# Altium schematic sheet AD7606.SchDoc
size A4
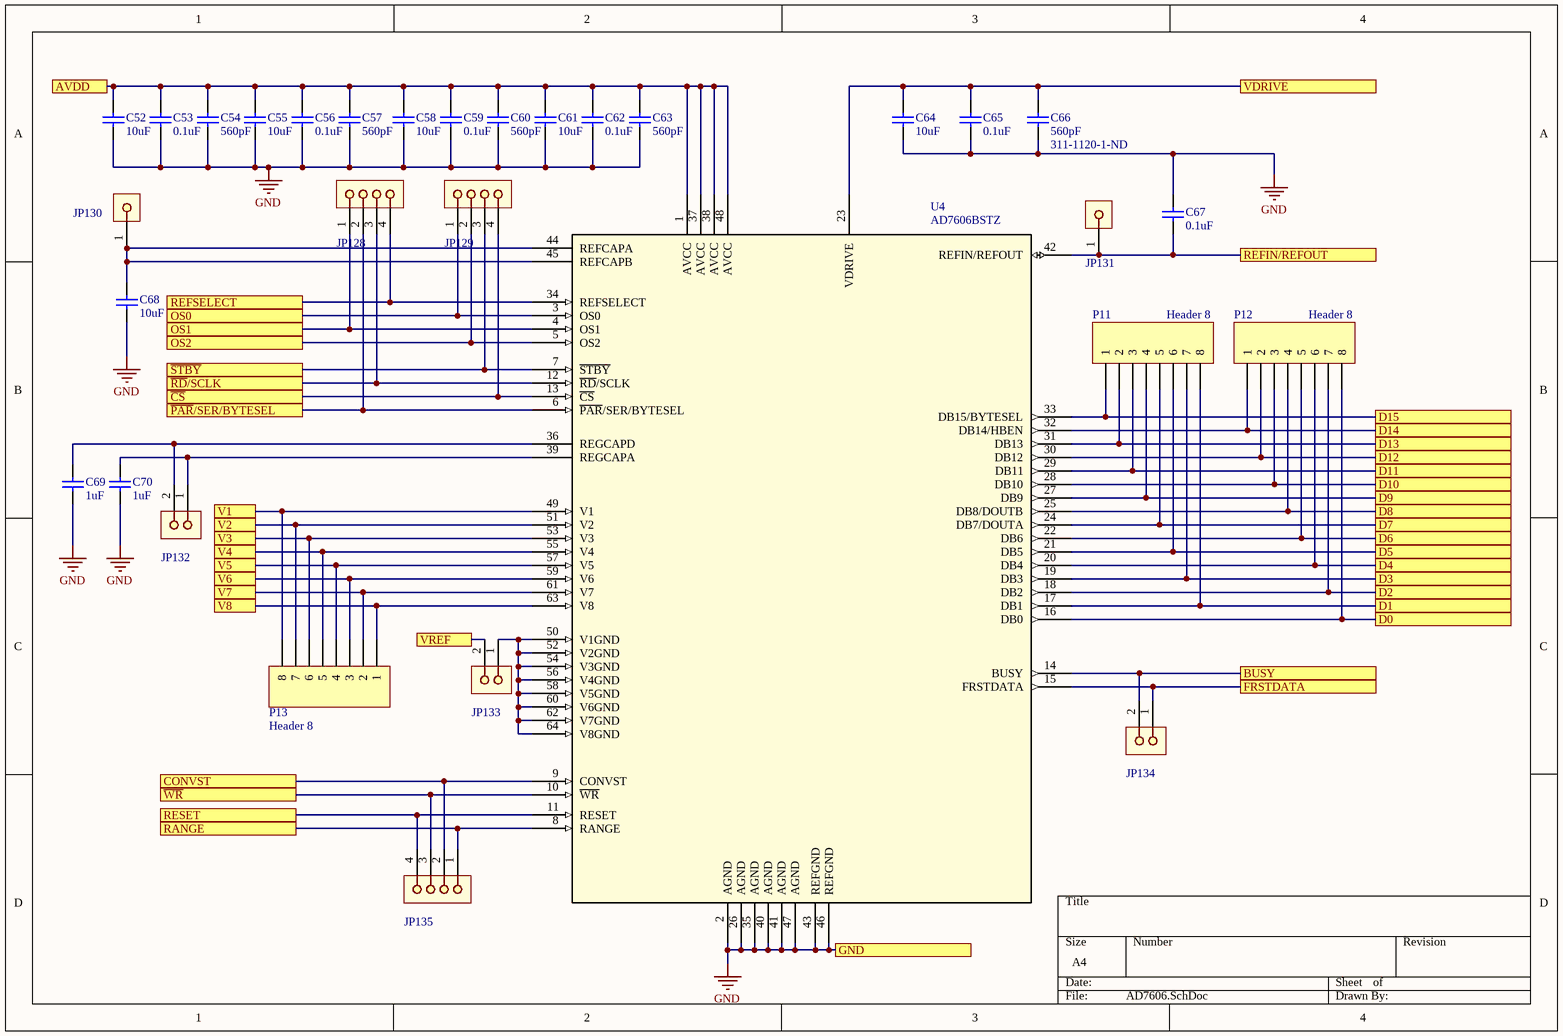
[diagram p0: AD7606.SchDoc]

## Parts
C52  10uF  [C0805]
C53  0.1uF  [C0805]
C54  560pF  [C0805]
C55  10uF  [C0805]
C56  0.1uF  [C0805]
C57  560pF  [C0805]
C58  10uF  [C0805]
C59  0.1uF  [C0805]
C60  560pF  [C0805]
C61  10uF  [C0805]
C62  0.1uF  [C0805]
C63  560pF  [C0805]
C64  10uF  [C0805]
C65  0.1uF  [C0805]
C66  560pF  Supplier Part Number 1: 311-1120-1-ND  [C0805]
C67  0.1uF  [C0805]
C68  10uF  [C0805]
C69  1uF  [C0805]
C70  1uF  [C0805]
JP128  01x04  [01x04_0.1in_th_straight_b_nom]  (value not drawn)
JP129  01x04  [01x04_0.1in_th_straight_b_nom]  (value not drawn)
JP130  01x01  [01x01_0_0.1in_th_straight_b_nom]  (value not drawn)
JP131  01x01  [01x01_0_0.1in_th_straight_b_nom]  (value not drawn)
JP132  01x02  [01x02_0.1in_th_straight_b_nom]  (value not drawn)
JP133  01x02  [01x02_0.1in_th_straight_b_nom]  (value not drawn)
JP134  01x02  [01x02_0.1in_th_straight_b_nom]  (value not drawn)
JP135  01x04  [01x04_0.1in_th_straight_b_nom]  (value not drawn)
P11  Header 8  [HDR1X8]
P12  Header 8  [HDR1X8]
P13  Header 8  [HDR1X8]
U4  AD7606BSTZ  [AD7606BSTZ]

## Ports
AVDD, BUSY, CONVST, D0, D1, D2, D3, D4, D5, D6, D7, D8, D9, D10, D11, D12, D13, D14, D15, FRSTDATA, GND, OS0, OS1, OS2, RANGE, REFIN/REFOUT, REFSELECT, RESET, V1, V2, V3, V4, V5, V6, V7, V8, VDRIVE, VREF, ~{CS}, ~{PAR}/SER/BYTESEL, ~{RD}/SCLK, ~{STBY}, ~{WR}

## Nets
GND: C52.1 C53.1 C54.1 C55.1 C56.1 C57.1 C58.1 C59.1 C60.1 C61.1 C62.1 C63.1 C64.1 C65.1 C66.1 C67.2 C68.1 C69.1 C70.1 U4.2(AGND) U4.26(AGND) U4.35(AGND) U4.40(AGND) U4.41(AGND) U4.43(REFGND) U4.46(REFGND) U4.47(AGND) ; port GND
AVDD: C52.2 C53.2 C54.2 C55.2 C56.2 C57.2 C58.2 C59.2 C60.2 C61.2 C62.2 C63.2 U4.1(AVCC) U4.37(AVCC) U4.38(AVCC) U4.48(AVCC) ; port AVDD
BUSY: JP134.2 U4.14(BUSY) ; port BUSY
~{CS}: JP129.4 U4.13(~{CS}) ; port ~{CS}
CONVST: JP135.2 U4.9(CONVST) ; port CONVST
D0: P12.8 U4.16(DB0) ; port D0
D1: P11.8 U4.17(DB1) ; port D1
D2: P12.7 U4.18(DB2) ; port D2
D3: P11.7 U4.19(DB3) ; port D3
D4: P12.6 U4.20(DB4) ; port D4
D5: P11.6 U4.21(DB5) ; port D5
D6: P12.5 U4.22(DB6) ; port D6
D7: P11.5 U4.24(DB7/DOUTA) ; port D7
D8: P12.4 U4.25(DB8/DOUTB) ; port D8
D9: P11.4 U4.27(DB9) ; port D9
D10: P12.3 U4.28(DB10) ; port D10
D11: P11.3 U4.29(DB11) ; port D11
D12: P12.2 U4.30(DB12) ; port D12
D13: P11.2 U4.31(DB13) ; port D13
D14: P12.1 U4.32(DB14/HBEN) ; port D14
D15: P11.1 U4.33(DB15/BYTESEL) ; port D15
FRSTDATA: JP134.1 U4.15(FRSTDATA) ; port FRSTDATA
OS0: JP129.1 U4.3(OS0) ; port OS0
OS1: JP128.1 U4.4(OS1) ; port OS1
OS2: JP129.2 U4.5(OS2) ; port OS2
~{PAR}/SER/BYTESEL: JP128.2 U4.6(~{PAR}/SER/BYTESEL) ; port ~{PAR}/SER/BYTESEL
~{RD}/SCLK: JP128.3 U4.12(~{RD}/SCLK) ; port ~{RD}/SCLK
RANGE: JP135.1 U4.8(RANGE) ; port RANGE
REFIN/REFOUT: C67.1 JP131.1 U4.42(REFIN/REFOUT) ; port REFIN/REFOUT
REFSELECT: JP128.4 U4.34(REFSELECT) ; port REFSELECT
RESET: JP135.4 U4.11(RESET) ; port RESET
~{STBY}: JP129.3 U4.7(~{STBY}) ; port ~{STBY}
V1: P13.8 U4.49(V1) ; port V1
V2: P13.7 U4.51(V2) ; port V2
V3: P13.6 U4.53(V3) ; port V3
V4: P13.5 U4.55(V4) ; port V4
V5: P13.4 U4.57(V5) ; port V5
V6: P13.3 U4.59(V6) ; port V6
V7: P13.2 U4.61(V7) ; port V7
V8: P13.1 U4.63(V8) ; port V8
VDRIVE: C64.2 C65.2 C66.2 U4.23(VDRIVE) ; port VDRIVE
VREF: JP133.2 ; port VREF
~{WR}: JP135.3 U4.10(~{WR}) ; port ~{WR}
NetC68_2: C68.2 JP130.1 U4.44(REFCAPA) U4.45(REFCAPB)
NetC69_2: C69.2 JP132.2 U4.36(REGCAPD)
NetC70_2: C70.2 JP132.1 U4.39(REGCAPA)
NetJP133_1: JP133.1 U4.50(V1GND) U4.52(V2GND) U4.54(V3GND) U4.56(V4GND) U4.58(V5GND) U4.60(V6GND) U4.62(V7GND) U4.64(V8GND)

## Library data of the parts
C52 C55 C58 C61 C64 C68 = Cap 10uF: Manufacturer: Taiyo Yuden; Manufacturer Part Number: UMK212SD103KD-T; Dielectric Material: Ceramic; Capacitance: 10nF; Tolerance: 10%; Voltage Rating: 50V; Supplier 1: Digi-Key; Stock 1: 14125; Pricing 1: 1=0.47, 10=0.323, 100=0.1941, 500=0.1455, 1000=0.1229 (USD); Mount: Surface Mount; Case/Package: 0805; Number of Pins: 2; Case Code (Metric): 2012; Case Code (Imperial): 0805; Min Operating Temperature: -55°C; Max Operating Temperature: 125°C; Packaging: Tape and Reel; Package Quantity: 1; Voltage Rating (DC): 50V; Termination: SMD/SMT; Length: 2mm; Height: 0.85mm; Width: 0.049inch; Thickness: 0.037inch; Depth: 1.25mm; Radiation Hardening: No; Lead Free: Lead Free; Halogen Free: Halogen Free; ComponentLink1URL: https://datasheet.ciiva.com/138/umk212sd103kd-t-ss-138661.pdf; ComponentLink1Description: https://datasheet.ciiva.com/138/umk212sd103kd-t-ss-138661.pdf; ComponentLink2URL: https://datasheet.ciiva.com/138/mlcc07-e-138662.pdf; ComponentLink2Description: https://datasheet.ciiva.com/138/mlcc07-e-138662.pdf; ComponentLink3URL: https://datasheet.ciiva.com/138/mlcc07-e-138663.pdf; ComponentLink3Description: https://datasheet.ciiva.com/138/mlcc07-e-138663.pdf; ComponentLink4URL: https://datasheet.ciiva.com/30140/303umk212sd103kd-t-30140925.pdf; ComponentLink4Description: https://datasheet.ciiva.com/30140/303umk212sd103kd-t-30140925.pdf; Supplier Part Number 1: 587-1114-1-ND
C53 C56 C59 C62 C65 C67 = Cap 0.1uF: Manufacturer: Taiyo Yuden; Manufacturer Part Number: UMK212SD103KD-T; Dielectric Material: Ceramic; Capacitance: 10nF; Tolerance: 10%; Voltage Rating: 50V; Supplier 1: Digi-Key; Stock 1: 14125; Pricing 1: 1=0.47, 10=0.323, 100=0.1941, 500=0.1455, 1000=0.1229 (USD); Mount: Surface Mount; Case/Package: 0805; Number of Pins: 2; Case Code (Metric): 2012; Case Code (Imperial): 0805; Min Operating Temperature: -55°C; Max Operating Temperature: 125°C; Packaging: Tape and Reel; Package Quantity: 1; Voltage Rating (DC): 50V; Termination: SMD/SMT; Length: 2mm; Height: 0.85mm; Width: 0.049inch; Thickness: 0.037inch; Depth: 1.25mm; Radiation Hardening: No; Lead Free: Lead Free; Halogen Free: Halogen Free; ComponentLink1URL: https://datasheet.ciiva.com/138/umk212sd103kd-t-ss-138661.pdf; ComponentLink1Description: https://datasheet.ciiva.com/138/umk212sd103kd-t-ss-138661.pdf; ComponentLink2URL: https://datasheet.ciiva.com/138/mlcc07-e-138662.pdf; ComponentLink2Description: https://datasheet.ciiva.com/138/mlcc07-e-138662.pdf; ComponentLink3URL: https://datasheet.ciiva.com/138/mlcc07-e-138663.pdf; ComponentLink3Description: https://datasheet.ciiva.com/138/mlcc07-e-138663.pdf; ComponentLink4URL: https://datasheet.ciiva.com/30140/303umk212sd103kd-t-30140925.pdf; ComponentLink4Description: https://datasheet.ciiva.com/30140/303umk212sd103kd-t-30140925.pdf; Supplier Part Number 1: 587-1114-1-ND
C54 C57 C60 C63 C66 = Cap 560pF: Manufacturer: Taiyo Yuden; Manufacturer Part Number: UMK212SD103KD-T; Dielectric Material: Ceramic; Capacitance: 10nF; Tolerance: 10%; Voltage Rating: 50V; Stock 1: 14125; Pricing 1: 1=0.47, 10=0.323, 100=0.1941, 500=0.1455, 1000=0.1229 (USD); Mount: Surface Mount; Case/Package: 0805; Number of Pins: 2; Case Code (Metric): 2012; Case Code (Imperial): 0805; Min Operating Temperature: -55°C; Max Operating Temperature: 125°C; Packaging: Tape and Reel; Package Quantity: 1; Voltage Rating (DC): 50V; Termination: SMD/SMT; Length: 2mm; Height: 0.85mm; Width: 0.049inch; Thickness: 0.037inch; Depth: 1.25mm; Radiation Hardening: No; Lead Free: Lead Free; Halogen Free: Halogen Free; ComponentLink1URL: https://datasheet.ciiva.com/138/umk212sd103kd-t-ss-138661.pdf; ComponentLink1Description: https://datasheet.ciiva.com/138/umk212sd103kd-t-ss-138661.pdf; ComponentLink2URL: https://datasheet.ciiva.com/138/mlcc07-e-138662.pdf; ComponentLink2Description: https://datasheet.ciiva.com/138/mlcc07-e-138662.pdf; ComponentLink3URL: https://datasheet.ciiva.com/138/mlcc07-e-138663.pdf; ComponentLink3Description: https://datasheet.ciiva.com/138/mlcc07-e-138663.pdf; ComponentLink4URL: https://datasheet.ciiva.com/30140/303umk212sd103kd-t-30140925.pdf; ComponentLink4Description: https://datasheet.ciiva.com/30140/303umk212sd103kd-t-30140925.pdf; Supplier 1: Digi-Key
  C54 C57 C60 C63: Supplier Part Number 1: 311-1120-1-ND
C69 C70 = Cap 1uF: Manufacturer: Taiyo Yuden; Manufacturer Part Number: UMK212SD103KD-T; Dielectric Material: Ceramic; Capacitance: 10nF; Tolerance: 10%; Voltage Rating: 50V; Supplier 1: Digi-Key; Stock 1: 14125; Pricing 1: 1=0.47, 10=0.323, 100=0.1941, 500=0.1455, 1000=0.1229 (USD); Mount: Surface Mount; Case/Package: 0805; Number of Pins: 2; Case Code (Metric): 2012; Case Code (Imperial): 0805; Min Operating Temperature: -55°C; Max Operating Temperature: 125°C; Packaging: Tape and Reel; Package Quantity: 1; Voltage Rating (DC): 50V; Termination: SMD/SMT; Length: 2mm; Height: 0.85mm; Width: 0.049inch; Thickness: 0.037inch; Depth: 1.25mm; Radiation Hardening: No; Lead Free: Lead Free; Halogen Free: Halogen Free; ComponentLink1URL: https://datasheet.ciiva.com/138/umk212sd103kd-t-ss-138661.pdf; ComponentLink1Description: https://datasheet.ciiva.com/138/umk212sd103kd-t-ss-138661.pdf; ComponentLink2URL: https://datasheet.ciiva.com/138/mlcc07-e-138662.pdf; ComponentLink2Description: https://datasheet.ciiva.com/138/mlcc07-e-138662.pdf; ComponentLink3URL: https://datasheet.ciiva.com/138/mlcc07-e-138663.pdf; ComponentLink3Description: https://datasheet.ciiva.com/138/mlcc07-e-138663.pdf; ComponentLink4URL: https://datasheet.ciiva.com/30140/303umk212sd103kd-t-30140925.pdf; ComponentLink4Description: https://datasheet.ciiva.com/30140/303umk212sd103kd-t-30140925.pdf; Supplier Part Number 1: 587-1114-1-ND
JP128 JP129 JP135 = 01x04: 01X04 generic terminal connector
JP130 JP131 = 01x01: 01X01 generic terminal connector
JP132-JP134 = 01x02: 01X02 generic terminal connector
P11-P13 = Header 8: Header, 8-Pin; LatestRevisionDate: 17-Jul-2002; LatestRevisionNote: Re-released for DXP Platform.; Publisher: Altium Limited
U4 = AD7606BSTZ: No Description Available; Vendor: Analog Devices Inc; Built_By: EMA_UL_Team; SourceLibrary: Analog_2015-01-06; Manufacturer_Part_Number: AD7606BSTZ; Copyright: Copyright (C) 2018 Accelerated Designs. All rights reserved; RefDes: RefDes; Type: DEV